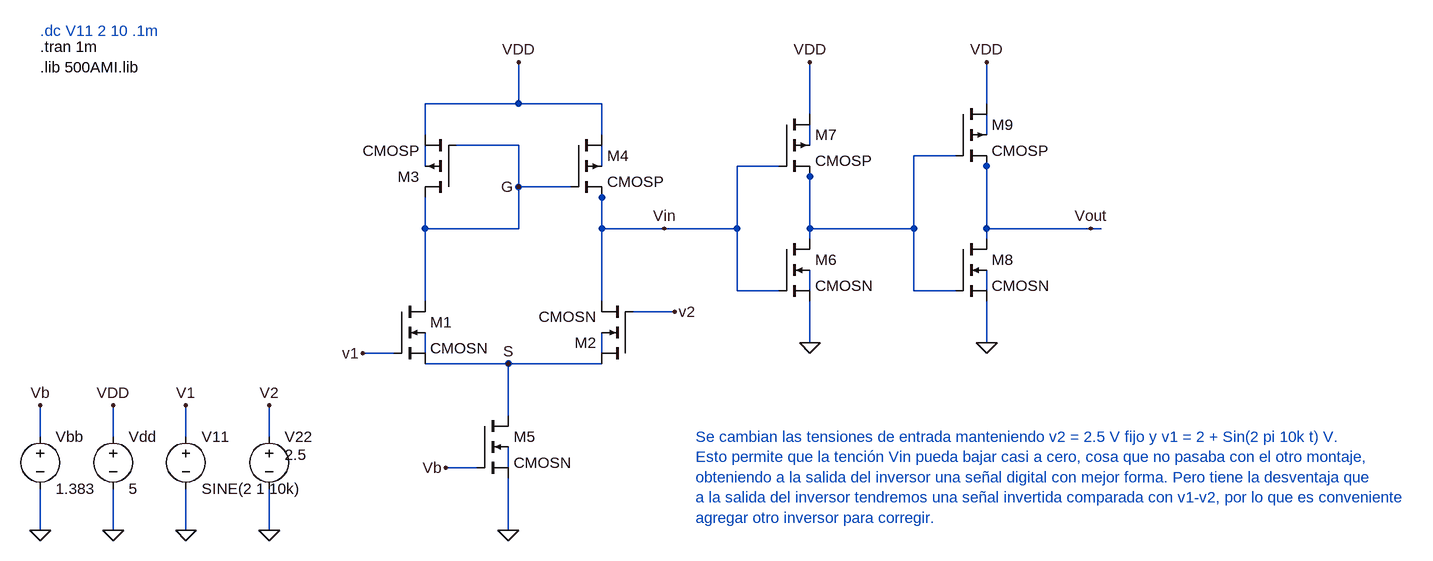
[diagram p0: schematic conversor v1.1.asc]
conversor v1.1.asc, the LTspice schematic file:
Version 4
SHEET 1 3276 1992
WIRE -32 -48 -32 -112
WIRE -32 -48 -176 -48
WIRE 96 -48 -32 -48
WIRE 688 -48 688 -112
WIRE 416 -32 416 -112
WIRE -176 0 -176 -48
WIRE 96 0 96 -48
WIRE 688 0 688 -32
WIRE -32 16 -128 16
WIRE 416 16 416 -16
WIRE 640 32 576 32
WIRE -176 48 -176 16
WIRE 96 48 96 16
WIRE 368 48 304 48
WIRE 688 48 688 32
WIRE 416 64 416 48
WIRE -32 80 -32 16
WIRE 48 80 -32 80
WIRE 96 96 96 80
WIRE -176 144 -176 96
WIRE -32 144 -32 80
WIRE -32 144 -176 144
WIRE 96 144 96 96
WIRE 192 144 96 144
WIRE 304 144 304 48
WIRE 304 144 192 144
WIRE 416 144 416 64
WIRE 576 144 576 32
WIRE 576 144 416 144
WIRE 688 144 688 48
WIRE 848 144 688 144
WIRE 864 144 848 144
WIRE 416 160 416 144
WIRE 688 160 688 144
WIRE 304 240 304 144
WIRE 368 240 304 240
WIRE 416 240 416 208
WIRE 576 240 576 144
WIRE 640 240 576 240
WIRE 688 240 688 208
WIRE -176 256 -176 144
WIRE 96 256 96 144
WIRE 208 272 144 272
WIRE 416 320 416 256
WIRE 688 320 688 256
WIRE -224 336 -272 336
WIRE -176 336 -176 304
WIRE 96 336 96 304
WIRE -48 352 -176 352
WIRE 96 352 -48 352
WIRE -48 432 -48 352
WIRE -768 464 -768 416
WIRE -656 464 -656 416
WIRE -544 464 -544 416
WIRE -416 464 -416 416
WIRE -96 512 -144 512
WIRE -48 512 -48 480
WIRE -768 608 -768 544
WIRE -656 608 -656 544
WIRE -544 608 -544 544
WIRE -416 608 -416 544
WIRE -48 608 -48 528
FLAG 688 320 0
FLAG 688 -112 VDD
FLAG -656 608 0
FLAG -48 608 0
FLAG -144 512 Vb
FLAG -32 -112 VDD
FLAG -656 416 VDD
FLAG -544 608 0
FLAG -544 416 V1
FLAG -416 608 0
FLAG -416 416 V2
FLAG -768 608 0
FLAG -768 416 Vb
FLAG 416 320 0
FLAG 416 -112 VDD
FLAG 192 144 Vin
FLAG -272 336 v1
FLAG 208 272 v2
FLAG -48 352 S
FLAG -32 80 G
FLAG 848 144 Vout
SYMBOL nmos4 640 160 R0
SYMATTR InstName M8
SYMATTR Value CMOSN
SYMATTR Value2 l=10u w=10u
SYMBOL pmos4 640 -48 R0
SYMATTR InstName M9
SYMATTR Value CMOSP
SYMATTR Value2 l=10u w=10u
SYMBOL pmos4 48 0 R0
SYMATTR InstName M4
SYMATTR Value CMOSP
SYMATTR Value2 l=10u w=10u
SYMBOL nmos4 -96 432 R0
SYMATTR InstName M5
SYMATTR Value CMOSN
SYMATTR Value2 l=10u w=10u
SYMBOL voltage -656 448 R0
WINDOW 123 0 0 Left 0
WINDOW 39 0 0 Left 0
SYMATTR InstName Vdd
SYMATTR Value 5
SYMBOL nmos4 144 352 R180
SYMATTR InstName M2
SYMATTR Value CMOSN
SYMATTR Value2 l=10u w=10u
SYMBOL pmos4 -128 96 R180
SYMATTR InstName M3
SYMATTR Value CMOSP
SYMATTR Value2 l=10u w=10u
SYMBOL voltage -544 448 R0
WINDOW 123 0 0 Left 0
WINDOW 39 0 0 Left 0
SYMATTR InstName V11
SYMATTR Value SINE(2 1 10k)
SYMBOL voltage -416 448 R0
WINDOW 3 24 44 Left 2
WINDOW 123 0 0 Left 0
WINDOW 39 0 0 Left 0
SYMATTR InstName V22
SYMATTR Value 2.5
SYMBOL voltage -768 448 R0
WINDOW 123 0 0 Left 0
WINDOW 39 0 0 Left 0
SYMATTR InstName Vbb
SYMATTR Value 1.383
SYMBOL nmos4 -224 256 R0
SYMATTR InstName M1
SYMATTR Value CMOSN
SYMATTR Value2 l=10u w=10u
SYMBOL nmos4 368 160 R0
SYMATTR InstName M6
SYMATTR Value CMOSN
SYMATTR Value2 l=10u w=10u
SYMBOL pmos4 368 -32 R0
SYMATTR InstName M7
SYMATTR Value CMOSP
SYMATTR Value2 l=10u w=10u
TEXT -768 -136 Left 2 !.tran 1m
TEXT -768 -160 Left 2 ;.dc V11 2 10 .1m
TEXT -768 -104 Left 2 !.lib 500AMI.lib
TEXT 240 464 Left 2 ;Se cambian las tensiones de entrada manteniendo v2 = 2.5 V fijo y v1 = 2 + Sin(2 pi 10k t) V. \nEsto permite que la tención Vin pueda bajar casi a cero, cosa que no pasaba con el otro montaje,\nobteniendo a la salida del inversor una señal digital con mejor forma. Pero tiene la desventaja que \na la salida del inversor tendremos una señal invertida comparada con v1-v2, por lo que es conveniente\nagregar otro inversor para corregir.

The netlist it stands for:
* conversor v1.1.asc
M8 Vout N003 0 N007 CMOSN l=10u w=10u
M9 VDD N003 Vout N001 CMOSP l=10u w=10u
M4 VDD G Vin N005 CMOSP l=10u w=10u
M5 S Vb 0 N010 CMOSN l=10u w=10u
Vdd VDD 0 5
M2 S V2 Vin N009 CMOSN l=10u w=10u
M3 G G VDD N004 CMOSP l=10u w=10u
V11 V1 0 SINE(2 1 10k)
V22 V2 0 2.5
Vbb Vb 0 1.383
M1 G V1 S N008 CMOSN l=10u w=10u
M6 N003 Vin 0 N006 CMOSN l=10u w=10u
M7 VDD Vin N003 N002 CMOSP l=10u w=10u
.model NMOS NMOS
.model PMOS PMOS
.lib standard.mos
.tran 1m
* .dc V11 2 10 .1m
.lib 500AMI.lib
* Se cambian las tensiones de entrada manteniendo v2 = 2.5 V fijo y v1 = 2 + Sin(2 pi 10k t) V.
* Esto permite que la tención Vin pueda bajar casi a cero, cosa que no pasaba con el otro montaje,
* obteniendo a la salida del inversor una señal digital con mejor forma. Pero tiene la desventaja que
* a la salida del inversor tendremos una señal invertida comparada con v1-v2, por lo que es conveniente
* agregar otro inversor para corregir.
.backanno
.end